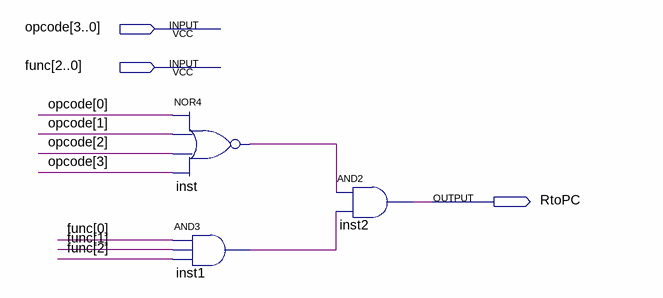
[diagram p0: schematic sheet]
// Quartus schematic RtoPC.bdf as structural Verilog: 3 symbols, 3 pins
module RtoPC (
  input  [3:0] opcode,
  input  [2:0] func,
  output RtoPC
);

  wire inst1_out, inst_out;

  nor inst (inst_out, opcode[0], opcode[1], opcode[2], opcode[3]);
  and inst1 (inst1_out, func[0], func[1], func[2]);
  and inst2 (RtoPC, inst_out, inst1_out);
endmodule
